# Altium schematic sheet main schematic.SchDoc
size A1
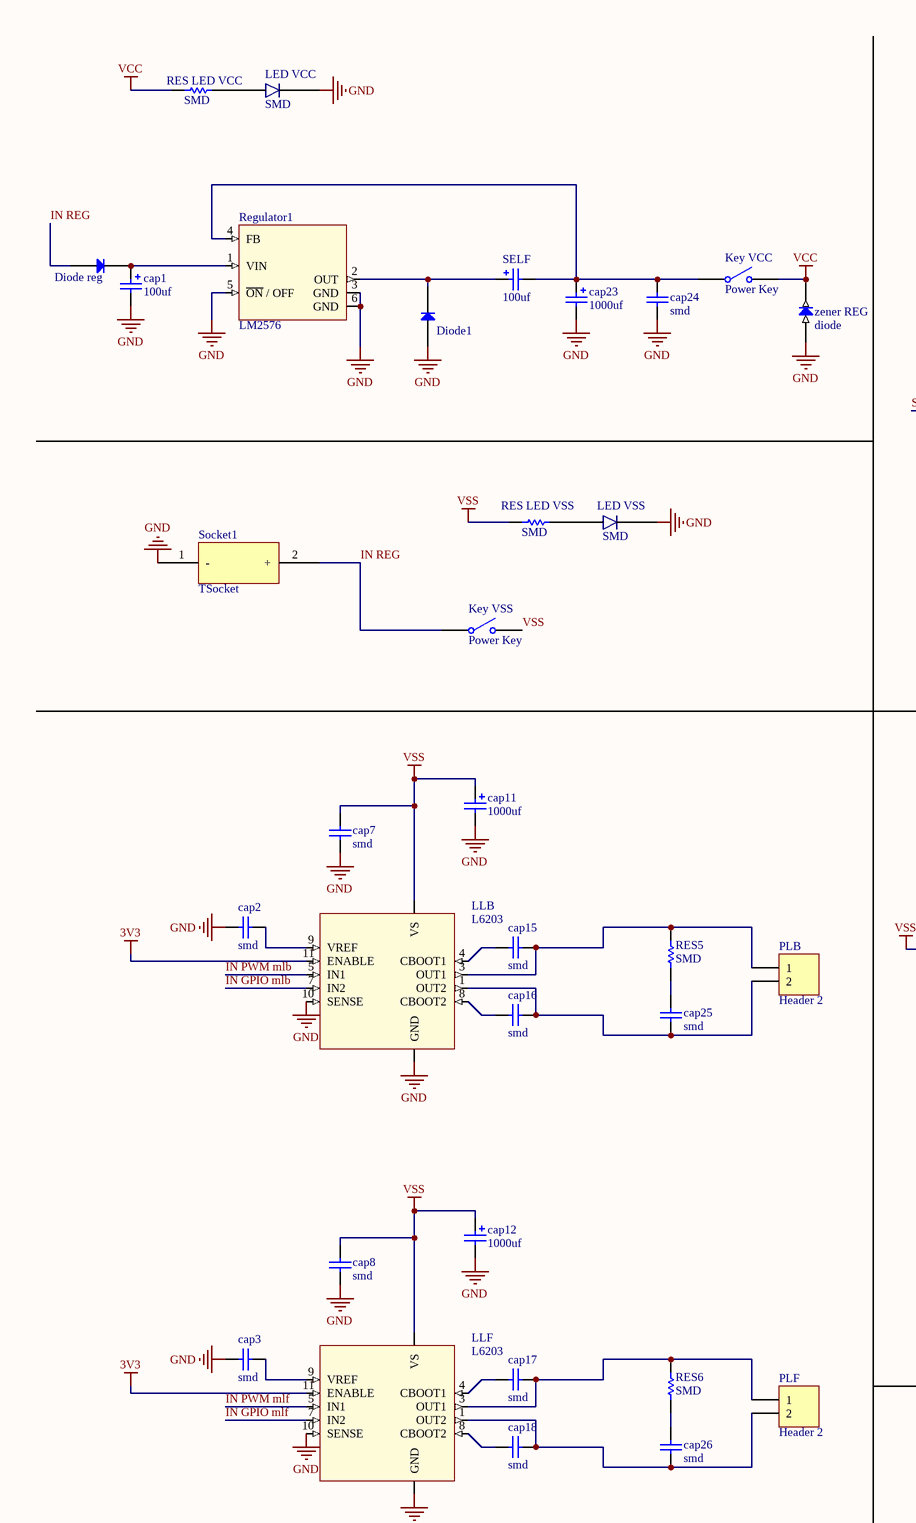
[diagram p0: main schematic.SchDoc, top left]
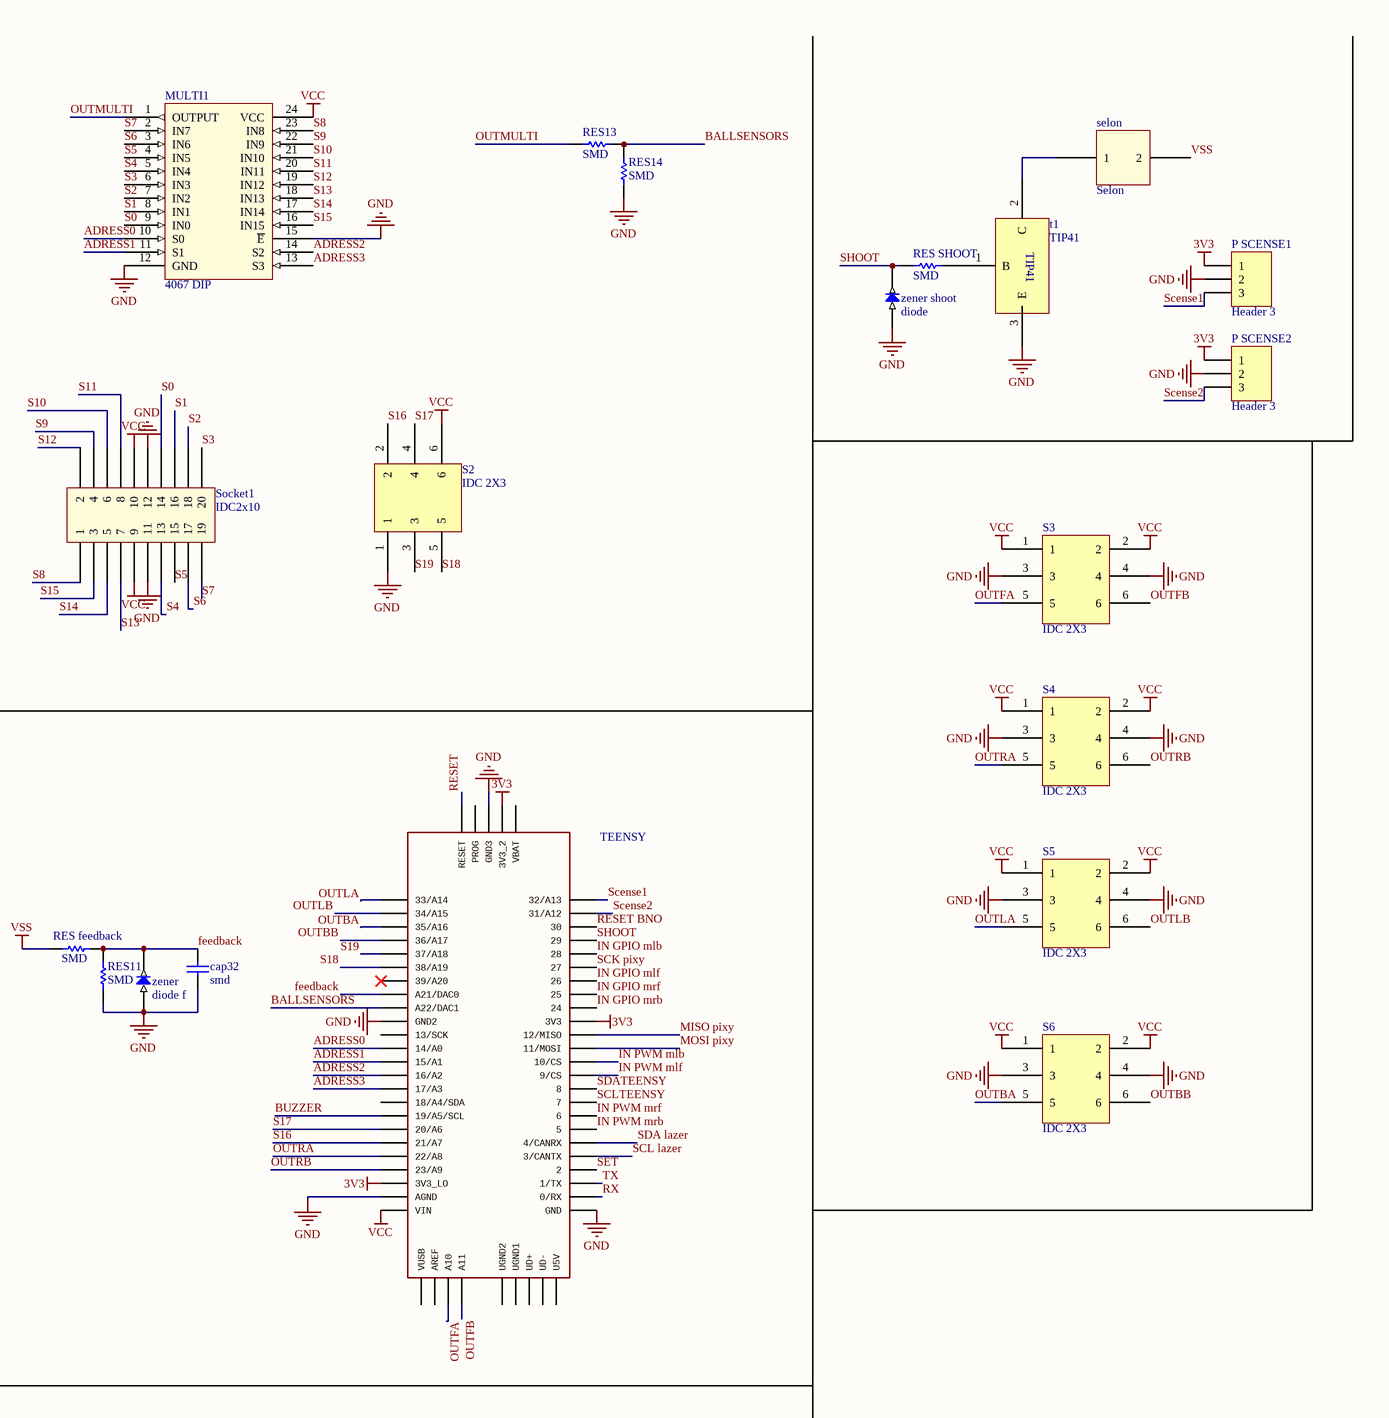
[diagram p1: main schematic.SchDoc, top right]
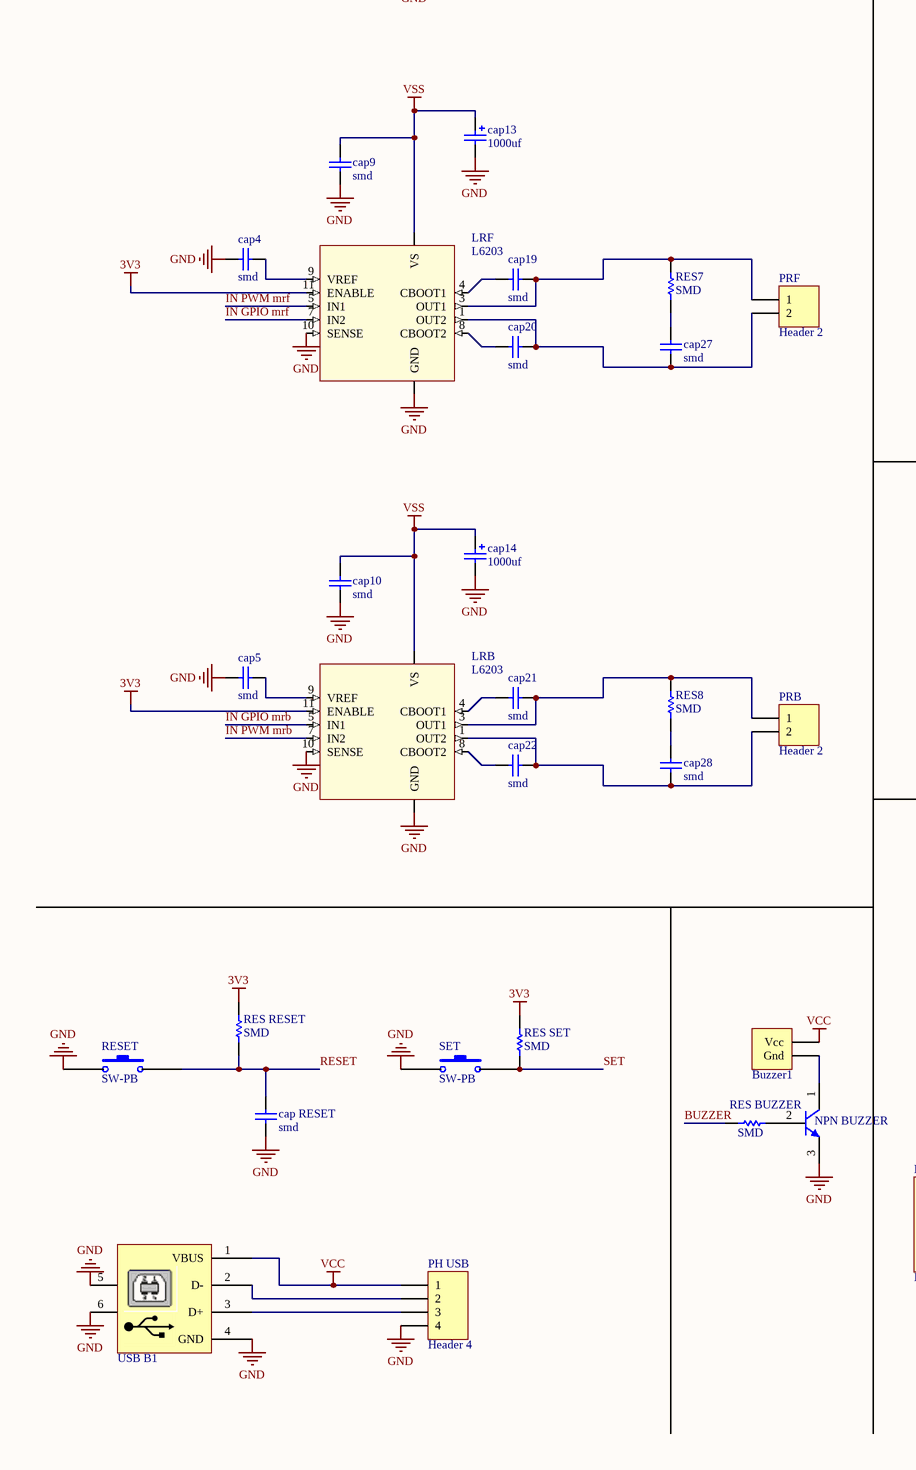
[diagram p2: main schematic.SchDoc, bottom left]
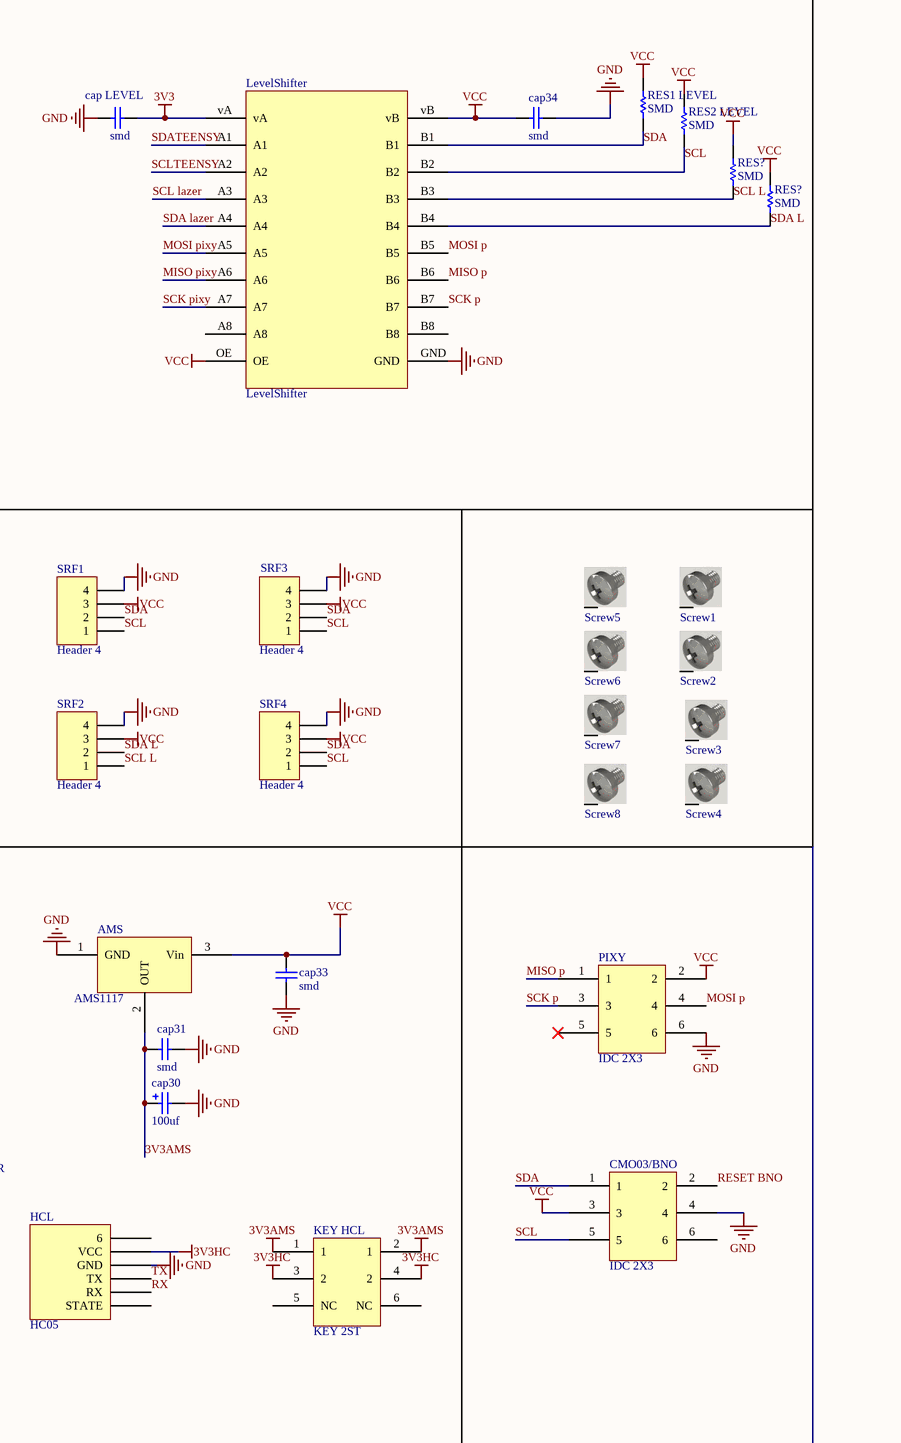
[diagram p3: main schematic.SchDoc, bottom right]

## Parts
(Parts that share a designator on the sheet are numbered #1, #2 ... from top to bottom, then left to right.)
AMS  AMS1117  [SOT223]
Buzzer1  Buzzer  [Buzzer]  (value not drawn)
cap1  100uf  [Cap 100uF]
cap2  smd  [Cap SMD]
cap3  smd  [Cap SMD]
cap4  smd  [Cap SMD]
cap5  smd  [Cap SMD]
cap7  smd  [Cap SMD]
cap8  smd  [Cap SMD]
cap9  smd  [Cap SMD]
cap10  smd  [Cap SMD]
cap11  1000uf  [Cap 1000uf]
cap12  1000uf  [Cap 1000uf]
cap13  1000uf  [Cap 1000uf]
cap14  1000uf  [Cap 1000uf]
cap15  smd  [Cap SMD]
cap16  smd  [Cap SMD]
cap17  smd  [Cap SMD]
cap18  smd  [Cap SMD]
cap19  smd  [Cap SMD]
cap20  smd  [Cap SMD]
cap21  smd  [Cap SMD]
cap22  smd  [Cap SMD]
cap23  1000uf  [Cap 1000uf]
cap24  smd  [Cap SMD]
cap25  smd  [Cap SMD]
cap26  smd  [Cap SMD]
cap27  smd  [Cap SMD]
cap28  smd  [Cap SMD]
cap30  100uf  [Cap 100uF]
cap31  smd  [Cap SMD]
cap32  smd  [Cap SMD]
cap33  smd  [Cap SMD]
cap34  smd  [Cap SMD]
cap_LEVEL  smd  [Cap SMD]
cap_RESET  smd  [Cap SMD]
CMO03/BNO  IDC 2X3  [IDC 2X3]
Diode1  Diode  [Diode]  (value not drawn)
Diode_reg  Diode  [Diode]  (value not drawn)
HCL  HC05  [HC05]
KEY_HCL  KEY 2ST  [KEY 2ST]
Key_VCC  Power Key  [Power Key]
Key_VSS  Power Key  [Power Key]
LED_VCC  SMD  [LED SMD]
LED_VSS  SMD  [LED SMD]
LevelShifter  LevelShifter  [CJMCU]
LLB  L6203  [MultiWatt11]
LLF  L6203  [MultiWatt11]
LRB  L6203  [MultiWatt11]
LRF  L6203  [MultiWatt11]
MULTI1  4067 DIP  [4067 DIP]
NPN_BUZZER  N2222A  [NPN]  (value not drawn)
P_SCENSE1  Header 3  [HDR1X3]
P_SCENSE2  Header 3  [HDR1X3]
PH_USB  Header 4  [HDR1X4]
PIXY  IDC 2X3  [IDC 2X3]
PLB  Header 2  [HDR1X2]
PLF  Header 2  [HDR1X2]
PRB  Header 2  [HDR1X2]
PRF  Header 2  [HDR1X2]
Regulator1  LM2576  [D2PAK]
RES1_LEVEL  SMD  [Resistor SMD 1206]
RES2_LEVEL  SMD  [Resistor SMD 1206]
RES5  SMD  [Resistor SMD 1206]
RES6  SMD  [Resistor SMD 1206]
RES7  SMD  [Resistor SMD 1206]
RES8  SMD  [Resistor SMD 1206]
RES11  SMD  [Resistor SMD 1206]
RES13  SMD  [Resistor SMD 1206]
RES14  SMD  [Resistor SMD 1206]
RES?#1  SMD  [Resistor SMD 1206]
RES?#2  SMD  [Resistor SMD 1206]
RES_BUZZER  SMD  [Resistor SMD 1206]
RES_feedback  SMD  [Resistor SMD 1206]
RES_LED_VCC  SMD  [Resistor SMD 1206]
RES_LED_VSS  SMD  [Resistor SMD 1206]
RES_RESET  SMD  [Resistor SMD 1206]
RES_SET  SMD  [Resistor SMD 1206]
RES_SHOOT  SMD  [Resistor SMD 1206]
RESET  SW-PB  [SW_2pin]
S2  IDC 2X3  [IDC 2X3]
S3  IDC 2X3  [IDC 2X3]
S4  IDC 2X3  [IDC 2X3]
S5  IDC 2X3  [IDC 2X3]
S6  IDC 2X3  [IDC 2X3]
Screw1  Screw  [Screw]  (value not drawn)
Screw2  Screw  [Screw]  (value not drawn)
Screw3  Screw  [Screw]  (value not drawn)
Screw4  Screw  [Screw]  (value not drawn)
Screw5  Screw  [Screw]  (value not drawn)
Screw6  Screw  [Screw]  (value not drawn)
Screw7  Screw  [Screw]  (value not drawn)
Screw8  Screw  [Screw]  (value not drawn)
SELF  100uf  [Cap 100uF]
selon  Selon  [Selon Con]
SET  SW-PB  [SW_2pin]
Socket1#1  IDC2x10  [IDC 2x10]
Socket1#2  TSocket  [TSocket]
SRF1  Header 4  [HDR1X4]
SRF2  Header 4  [HDR1X4]
SRF3  Header 4  [HDR1X4]
SRF4  Header 4  [HDR1X4]
t1  TIP41  [TIP41]
TEENSY  TEENSY_3.5/3.6  [TEENSY_3.5/3.6]  (value not drawn)
USB_B1  USB_B  [USB_B.1]  (value not drawn)
zener  diode f  [LED SMD]
zener_REG  diode  [LED SMD]
zener_shoot  diode  [LED SMD]

## Nets
3V3: cap_LEVEL.2 LevelShifter.vA LLB.11(ENABLE) LLF.11(ENABLE) LRB.11(ENABLE) LRF.11(ENABLE) P_SCENSE1.1 P_SCENSE2.1 RES_RESET.2 RES_SET.2 TEENSY.3V3 TEENSY.3V3_2 TEENSY.3V3_LO
3V3AMS: AMS.2(OUT) cap30.1 cap31.1 KEY_HCL.1 KEY_HCL.2(1)
3V3HC: HCL.5(VCC) KEY_HCL.3(2) KEY_HCL.4(2)
GND: AMS.1(GND) cap1.2 cap2.1 cap3.1 cap4.1 cap5.1 cap7.1 cap8.1 cap9.1 cap10.1 cap11.2 cap12.2 cap13.2 cap14.2 cap23.2 cap24.1 cap30.2 cap31.2 cap32.1 cap33.1 cap34.2 cap_LEVEL.1 cap_RESET.1 CMO03/BNO.4 Diode1.1(A) HCL.4(GND) LED_VCC.2 LED_VSS.2 LevelShifter.GND LLB.6(GND) LLB.10(SENSE) LLF.6(GND) LLF.10(SENSE) LRB.6(GND) LRB.10(SENSE) LRF.6(GND) LRF.10(SENSE) MULTI1.12(GND) MULTI1.15(~{E}) NPN_BUZZER.3(E) P_SCENSE1.2 P_SCENSE2.2 PH_USB.4 PIXY.6 Regulator1.3(GND) Regulator1.5(~{ON}_/_OFF) Regulator1.6(GND) RES11.1 RES14.1 RESET.2 S2.1 S3.3 S3.4 S4.3 S4.4 S5.3 S5.4 S6.3 S6.4 SET.2 Socket1#1.11 Socket1#1.12 Socket1#2.1(-) SRF1.4 SRF2.4 SRF3.4 SRF4.4 t1.3(E) TEENSY.AGND TEENSY.GND TEENSY.GND2 TEENSY.GND3 USB_B1.4(GND) USB_B1.5 USB_B1.6 zener.1(in) zener_REG.1(in) zener_shoot.1(in)
VCC: AMS.3(Vin) Buzzer1.1(Vcc) cap33.2 cap34.1 CMO03/BNO.3 Key_VCC.2(NO) LevelShifter.OE LevelShifter.vB MULTI1.24(VCC) PH_USB.1 PIXY.2 RES1_LEVEL.2 RES2_LEVEL.2 RES?#1.2 RES?#2.2 RES_LED_VCC.1 S2.6 S3.1 S3.2 S4.1 S4.2 S5.1 S5.2 S6.1 S6.2 Socket1#1.9 Socket1#1.10 SRF1.3 SRF2.3 SRF3.3 SRF4.3 TEENSY.VIN USB_B1.1(VBUS) zener_REG.2(out)
VSS: cap7.2 cap8.2 cap9.2 cap10.2 cap11.1 cap12.1 cap13.1 cap14.1 Key_VSS.2(NO) LLB.2(VS) LLF.2(VS) LRB.2(VS) LRF.2(VS) RES_feedback.1 RES_LED_VSS.1 selon.2
ADRESS0: MULTI1.10(S0) TEENSY.14/A0
ADRESS1: MULTI1.11(S1) TEENSY.15/A1
ADRESS2: MULTI1.14(S2) TEENSY.16/A2
ADRESS3: MULTI1.13(S3) TEENSY.17/A3
BALLSENSORS: RES13.2 RES14.2 TEENSY.A22/DAC1
BUZZER: RES_BUZZER.1 TEENSY.19/A5/SCL
feedback: cap32.2 RES11.2 RES_feedback.2 TEENSY.21/DAC0(A21/DAC0) zener.2(out)
IN GPIO mlb: LLB.7(IN2) TEENSY.28
IN GPIO mlf: LLF.7(IN2) TEENSY.26
IN GPIO mrb: LRB.5(IN1) TEENSY.24
IN GPIO mrf: LRF.7(IN2) TEENSY.25
IN PWM mlb: LLB.5(IN1) TEENSY.10/CS
IN PWM mlf: LLF.5(IN1) TEENSY.9/CS
IN PWM mrb: LRB.7(IN2) TEENSY.5
IN PWM mrf: LRF.5(IN1) TEENSY.6
IN REG: Diode_reg.1(A) Key_VSS.1(COMMON) Socket1#2.2(+)
MISO p: LevelShifter.B6 PIXY.1
MISO pixy: LevelShifter.A6 TEENSY.12/MISO
MOSI p: LevelShifter.B5 PIXY.4
MOSI pixy: LevelShifter.A5 TEENSY.11/MOSI
OUTBA: S6.5 TEENSY.35/A16
OUTBB: S6.6 TEENSY.36/A17
OUTFA: S3.5 TEENSY.A10
OUTFB: S3.6 TEENSY.A11
OUTLA: S5.5 TEENSY.33/A14
OUTLB: S5.6 TEENSY.34/A15
OUTMULTI: MULTI1.1(OUTPUT) RES13.1
OUTRA: S4.5 TEENSY.22/A8
OUTRB: S4.6 TEENSY.23/A9
RESET: cap_RESET.2 RES_RESET.1 RESET.1 TEENSY.RESET
RESET BNO: CMO03/BNO.2 TEENSY.30
RX: HCL.2(RX) TEENSY.0/RX
S0: MULTI1.9(IN0) Socket1#1.14
S1: MULTI1.8(IN1) Socket1#1.16
S2: MULTI1.7(IN2) Socket1#1.18
S3: MULTI1.6(IN3) Socket1#1.20
S4: MULTI1.5(IN4) Socket1#1.13
S5: MULTI1.4(IN5) Socket1#1.15
S6: MULTI1.3(IN6) Socket1#1.17
S7: MULTI1.2(IN7) Socket1#1.19
S8: MULTI1.23(IN8) Socket1#1.1
S9: MULTI1.22(IN9) Socket1#1.4
S10: MULTI1.21(IN10) Socket1#1.6
S11: MULTI1.20(IN11) Socket1#1.8
S12: MULTI1.19(IN12) Socket1#1.2
S13: MULTI1.18(IN13) Socket1#1.7
S14: MULTI1.17(IN14) Socket1#1.5
S15: MULTI1.16(IN15) Socket1#1.3
S16: S2.2 TEENSY.21/A7
S17: S2.4 TEENSY.20/A6
S18: S2.5 TEENSY.38/A19
S19: S2.3 TEENSY.37/A18
Scense1: P_SCENSE1.3 TEENSY.32/A13
Scense2: P_SCENSE2.3 TEENSY.31/A12
SCK p: LevelShifter.B7 PIXY.3
SCK pixy: LevelShifter.A7 TEENSY.27
SCL: CMO03/BNO.5 LevelShifter.B2 RES2_LEVEL.1 SRF1.1 SRF3.1 SRF4.1
SCL L: LevelShifter.B3 RES?#1.1 SRF2.1
SCL lazer: LevelShifter.A3 TEENSY.3/CANTX
SCLTEENSY: LevelShifter.A2 TEENSY.7
SDA: CMO03/BNO.1 LevelShifter.B1 RES1_LEVEL.1 SRF1.2 SRF3.2 SRF4.2
SDA L: LevelShifter.B4 RES?#2.1 SRF2.2
SDA lazer: LevelShifter.A4 TEENSY.4/CANRX
SDATEENSY: LevelShifter.A1 TEENSY.8
SET: RES_SET.1 SET.1 TEENSY.2
SHOOT: RES_SHOOT.1 TEENSY.29 zener_shoot.2(out)
TX: HCL.3(TX) TEENSY.1/TX
NetBuzzer1_2: Buzzer1.2(Gnd) NPN_BUZZER.1(C)
Netcap1_1: cap1.1 Diode_reg.2(K) Regulator1.1(VIN)
Netcap2_2: cap2.2 LLB.9(VREF)
Netcap3_2: cap3.2 LLF.9(VREF)
Netcap4_2: cap4.2 LRF.9(VREF)
Netcap5_2: cap5.2 LRB.9(VREF)
Netcap15_1: cap15.1 LLB.4(CBOOT1)
Netcap15_2: cap15.2 LLB.3(OUT1) PLB.1 RES5.2
Netcap16_1: cap16.1 LLB.8(CBOOT2)
Netcap16_2: cap16.2 cap25.1 LLB.1(OUT2) PLB.2
Netcap17_1: cap17.1 LLF.4(CBOOT1)
Netcap17_2: cap17.2 LLF.3(OUT1) PLF.1 RES6.2
Netcap18_1: cap18.1 LLF.8(CBOOT2)
Netcap18_2: cap18.2 cap26.1 LLF.1(OUT2) PLF.2
Netcap19_1: cap19.1 LRF.4(CBOOT1)
Netcap19_2: cap19.2 LRF.3(OUT1) PRF.1 RES7.2
Netcap20_1: cap20.1 LRF.8(CBOOT2)
Netcap20_2: cap20.2 cap27.1 LRF.1(OUT2) PRF.2
Netcap21_1: cap21.1 LRB.4(CBOOT1)
Netcap21_2: cap21.2 LRB.3(OUT1) PRB.1 RES8.2
Netcap22_1: cap22.1 LRB.8(CBOOT2)
Netcap22_2: cap22.2 cap28.1 LRB.1(OUT2) PRB.2
Netcap23_1: cap23.1 cap24.2 Key_VCC.1(COMMON) Regulator1.4(FB) SELF.2
Netcap25_2: cap25.2 RES5.1
Netcap26_2: cap26.2 RES6.1
Netcap27_2: cap27.2 RES7.1
Netcap28_2: cap28.2 RES8.1
NetDiode1_2: Diode1.2(K) Regulator1.2(OUT) SELF.1
NetLED_VCC_1: LED_VCC.1 RES_LED_VCC.2
NetLED_VSS_1: LED_VSS.1 RES_LED_VSS.2
NetNPN_BUZZER_2: NPN_BUZZER.2(B) RES_BUZZER.2
NetPH_USB_2: PH_USB.2 USB_B1.2(D-)
NetPH_USB_3: PH_USB.3 USB_B1.3(D+)
NetRES_SHOOT_2: RES_SHOOT.2 t1.1(B)
Netselon_1: selon.1 t1.2(C)

Not connected (* = marked no-connect by the designer): CMO03/BNO 6; HCL 1(STATE) 6; KEY_HCL 5(NC) 6(NC); LevelShifter A8 B8; PIXY 5*; Screw1 S; Screw2 S; Screw3 S; Screw4 S; Screw5 S; Screw6 S; Screw7 S; Screw8 S; TEENSY 13/SCK 18/A4/SDA 39/A20* AREF PROG U5V UD+ UD- UGND1 UGND2 VBAT VUSB

## Library data of the parts
cap1 cap30 SELF = Cap 100uF
cap2-cap5 cap7-cap10 cap15-cap22 cap24-cap28 cap31-cap34 cap_LEVEL cap_RESET = Cap SMD
cap11-cap14 cap23 = Cap 1000uF
LED_VCC LED_VSS = LED SMD
NPN_BUZZER = NPN
P_SCENSE1 P_SCENSE2 = Header 3: Header, 3-Pin; LatestRevisionDate: 17-Jul-2002; LatestRevisionNote: Re-released for DXP Platform.; Publisher: Altium Limited
PH_USB SRF1-SRF4 = Header 4: Header, 4-Pin; LatestRevisionDate: 17-Jul-2002; LatestRevisionNote: Re-released for DXP Platform.; Publisher: Altium Limited
PLB PLF PRB PRF = Header 2: Header, 2-Pin; LatestRevisionDate: 17-Jul-2002; LatestRevisionNote: Re-released for DXP Platform.; Publisher: Altium Limited
RES1_LEVEL RES2_LEVEL RES5-RES8 RES11 RES13 RES14 RES?#1 RES?#2 RES_BUZZER RES_feedback RES_LED_VCC RES_LED_VSS RES_RESET RES_SET RES_SHOOT = Res SMD
RESET SET = SW-PB: Switch; Published: 24-Mar-1999; LatestRevisionDate: 17-Jul-2002; LatestRevisionNote: Re-released for DXP Platform.; PackageReference: SPST-2; Publisher: Altium Limited; PackageDescription: Switch; 2 Leads
Socket1#1 = IDC 2x10
TEENSY = TEENSY_3.5/3.6: GateName_1: G$1; SymbolName_1: TEENSY_3.5/3.6; LibraryName: Teensy356; DeviceSetName: TEENSY_3.5/3.6; Package: TEENSY_3.5/3.6
USB_B1 = USB_B: USB B; LatestRevisionDate: 17-Jul-2002; LatestRevisionNote: Re-released for DXP Platform.; Publisher: Altium Limited
zener zener_REG zener_shoot = SMDZenerDiode
Screw1-Screw8 = Screw: LatestRevisionDate: 17-Jul-2002; LatestRevisionNote: Re-released for DXP Platform.; Publisher: Altium Limited